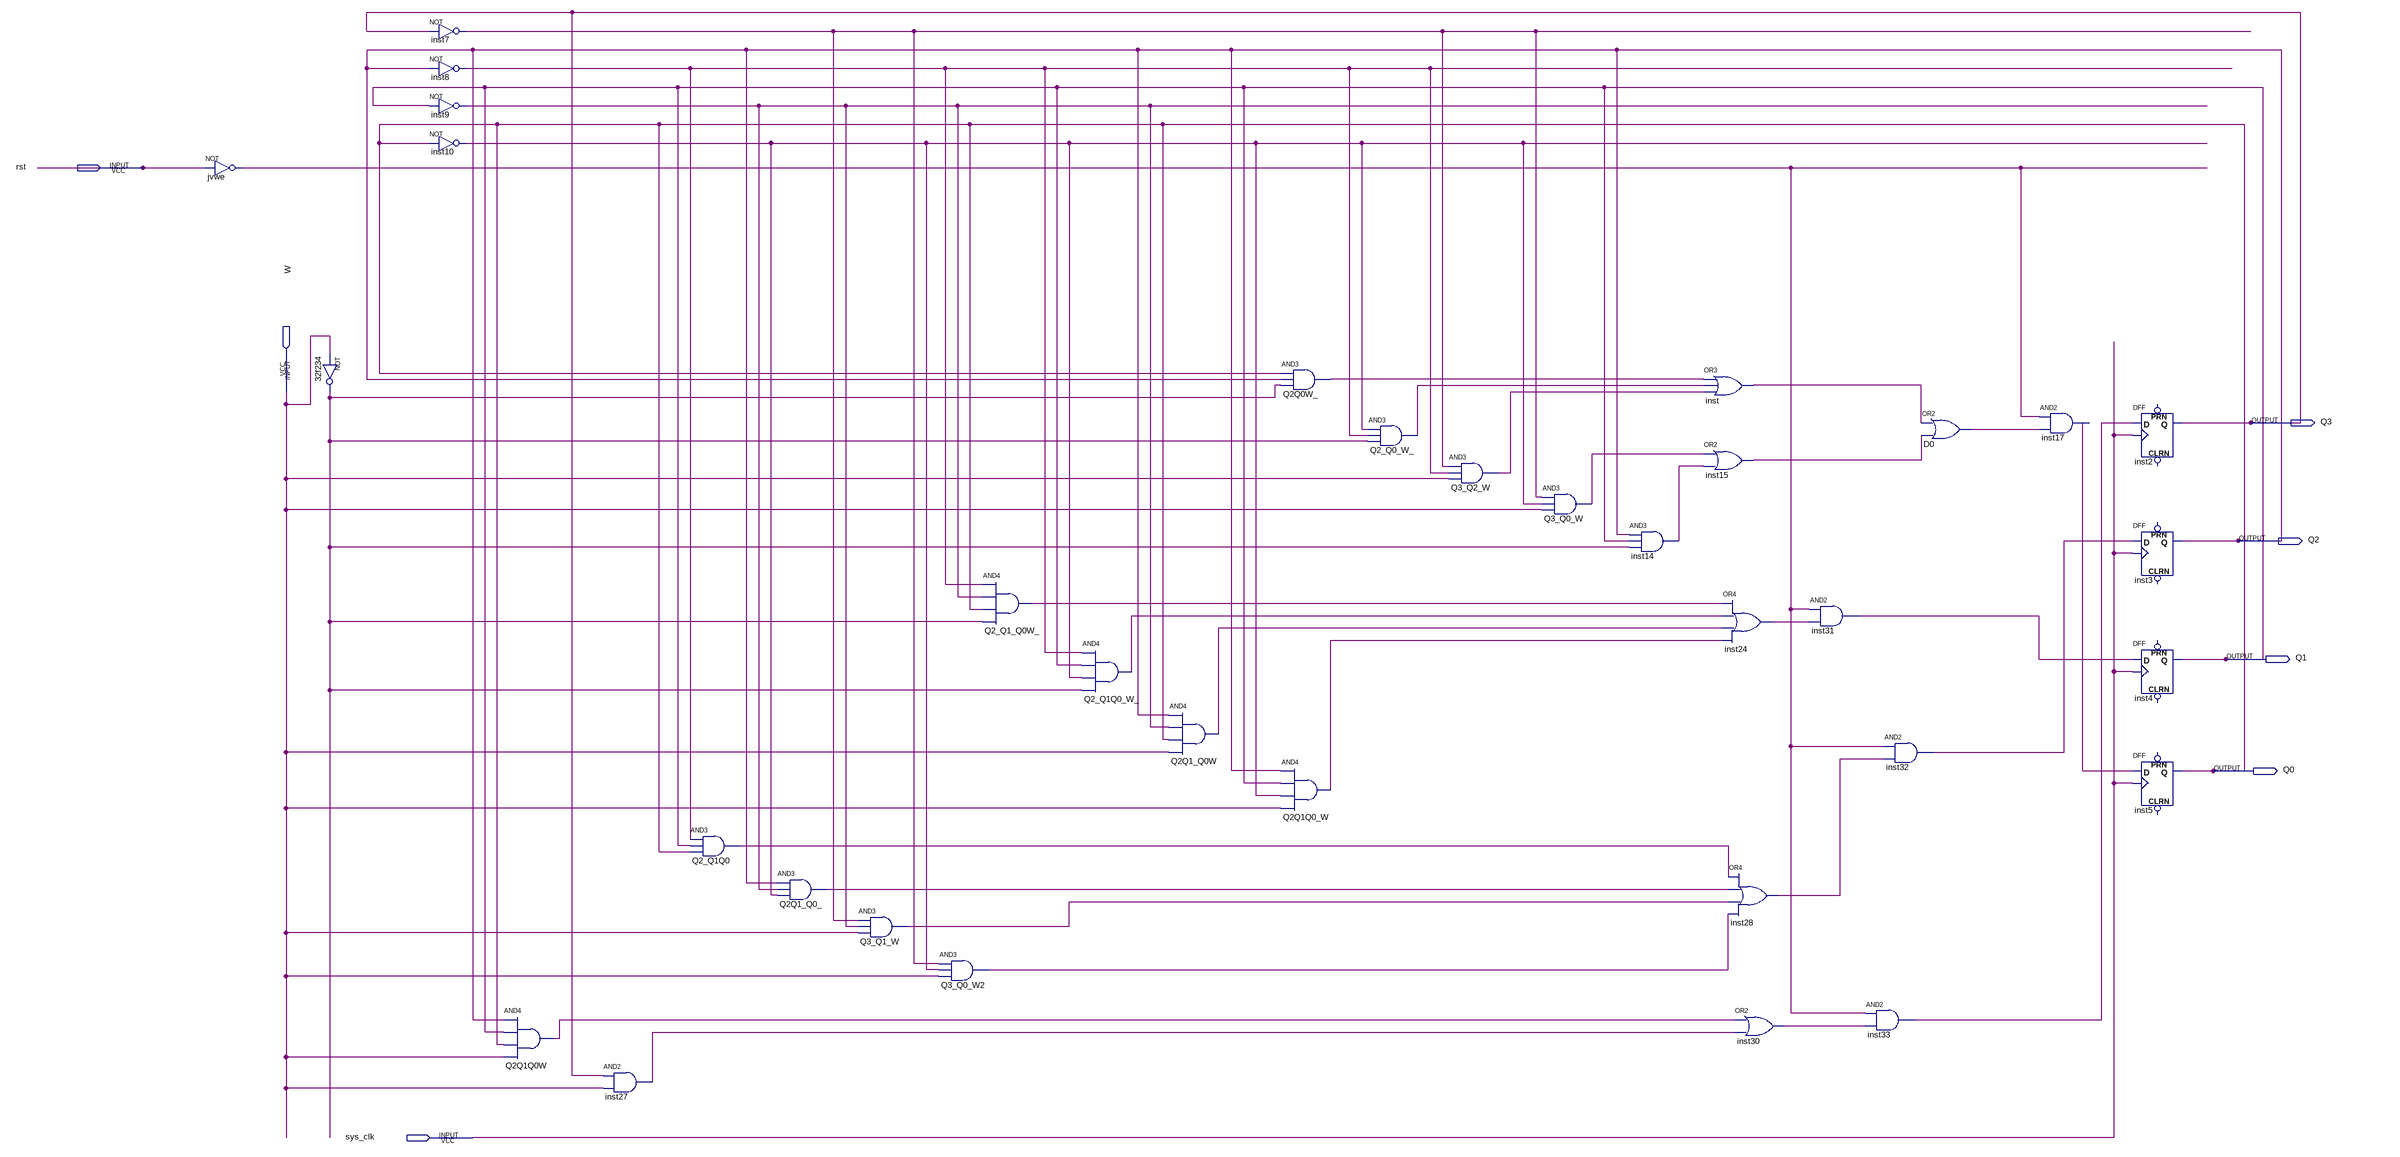
[diagram p0: schematic sheet]
// Quartus schematic digitallock.bdf as structural Verilog: 35 symbols, 7 pins
module digitallock (
  input  rst,
  input  W,
  input  sys_clk,
  output Q3,
  output Q2,
  output Q1,
  output Q0
);

  wire D0_out, inst7_out, inst8_out, inst9_out, inst10_out, inst14_out, inst15_out, inst17_out, inst24_out,
       inst27_out, inst28_out, inst30_out, inst31_out, inst32_out, inst33_out, inst_out, jvwe_out,
       n32f234_out, Q2_Q0_W__out, Q2_Q1_Q0W__out, Q2_Q1Q0_out, Q2_Q1Q0_W__out, Q2Q0W__out, Q2Q1_Q0__out,
       Q2Q1_Q0W_out, Q2Q1Q0_W_out, Q2Q1Q0W_out, Q3_Q0_W2_out, Q3_Q0_W_out, Q3_Q1_W_out, Q3_Q2_W_out;

  not jvwe (jvwe_out, rst);
  not u_32f234 (n32f234_out, W);
  not inst7 (inst7_out, Q3);
  not inst8 (inst8_out, Q2);
  not inst9 (inst9_out, Q1);
  not inst10 (inst10_out, Q0);
  and Q2Q1Q0W (Q2Q1Q0W_out, Q2, Q1, Q0, W);
  and inst27 (inst27_out, Q3, W);
  and Q2_Q1Q0 (Q2_Q1Q0_out, inst8_out, Q1, Q0);
  and Q2Q1_Q0_ (Q2Q1_Q0__out, Q2, inst9_out, inst10_out);
  and Q3_Q1_W (Q3_Q1_W_out, inst7_out, inst9_out, W);
  and Q3_Q0_W2 (Q3_Q0_W2_out, inst7_out, inst10_out, W);
  and Q2_Q1_Q0W_ (Q2_Q1_Q0W__out, inst8_out, inst9_out, Q0, n32f234_out);
  and Q2_Q1Q0_W_ (Q2_Q1Q0_W__out, inst8_out, Q1, inst10_out, n32f234_out);
  and Q2Q1_Q0W (Q2Q1_Q0W_out, Q2, inst9_out, Q0, W);
  and Q2Q0W_ (Q2Q0W__out, Q0, Q2, n32f234_out);
  and Q2Q1Q0_W (Q2Q1Q0_W_out, Q2, Q1, inst10_out, W);
  and Q2_Q0_W_ (Q2_Q0_W__out, inst10_out, inst8_out, n32f234_out);
  and Q3_Q2_W (Q3_Q2_W_out, inst7_out, inst8_out, W);
  and Q3_Q0_W (Q3_Q0_W_out, inst7_out, inst10_out, W);
  and inst14 (inst14_out, Q2, Q1, n32f234_out);
  or inst (inst_out, Q2Q0W__out, Q2_Q0_W__out, Q3_Q2_W_out);
  or inst15 (inst15_out, Q3_Q0_W_out, inst14_out);
  or inst24 (inst24_out, Q2_Q1_Q0W__out, Q2_Q1Q0_W__out, Q2Q1_Q0W_out, Q2Q1Q0_W_out);
  or inst28 (inst28_out, Q2_Q1Q0_out, Q2Q1_Q0__out, Q3_Q1_W_out, Q3_Q0_W2_out);
  or inst30 (inst30_out, Q2Q1Q0W_out, inst27_out);
  and inst31 (inst31_out, jvwe_out, inst24_out);
  and inst33 (inst33_out, jvwe_out, inst30_out);
  and inst32 (inst32_out, jvwe_out, inst28_out);
  or D0 (D0_out, inst_out, inst15_out);
  and inst17 (inst17_out, jvwe_out, D0_out);
  DFF inst2 (.CLK(sys_clk), .D(inst33_out), .Q(Q3));  // open: CLRN, PRN
  DFF inst3 (.CLK(sys_clk), .D(inst32_out), .Q(Q2));  // open: CLRN, PRN
  DFF inst4 (.CLK(sys_clk), .D(inst31_out), .Q(Q1));  // open: CLRN, PRN
  DFF inst5 (.CLK(sys_clk), .D(inst17_out), .Q(Q0));  // open: CLRN, PRN
endmodule
